# EAGLE schematic XuLA-6SLX (EAGLE 5.11)
AUTHOR: Dave Vandenbout / XESS Corp.; DIGIKEY#: 445-3447-1-ND; MANF: Xicon; MANF#: 301-5.1K-RC; MOUSER#: 301-5.1K-RC; VERSION#: 2.A

## Sheet 1 of 3
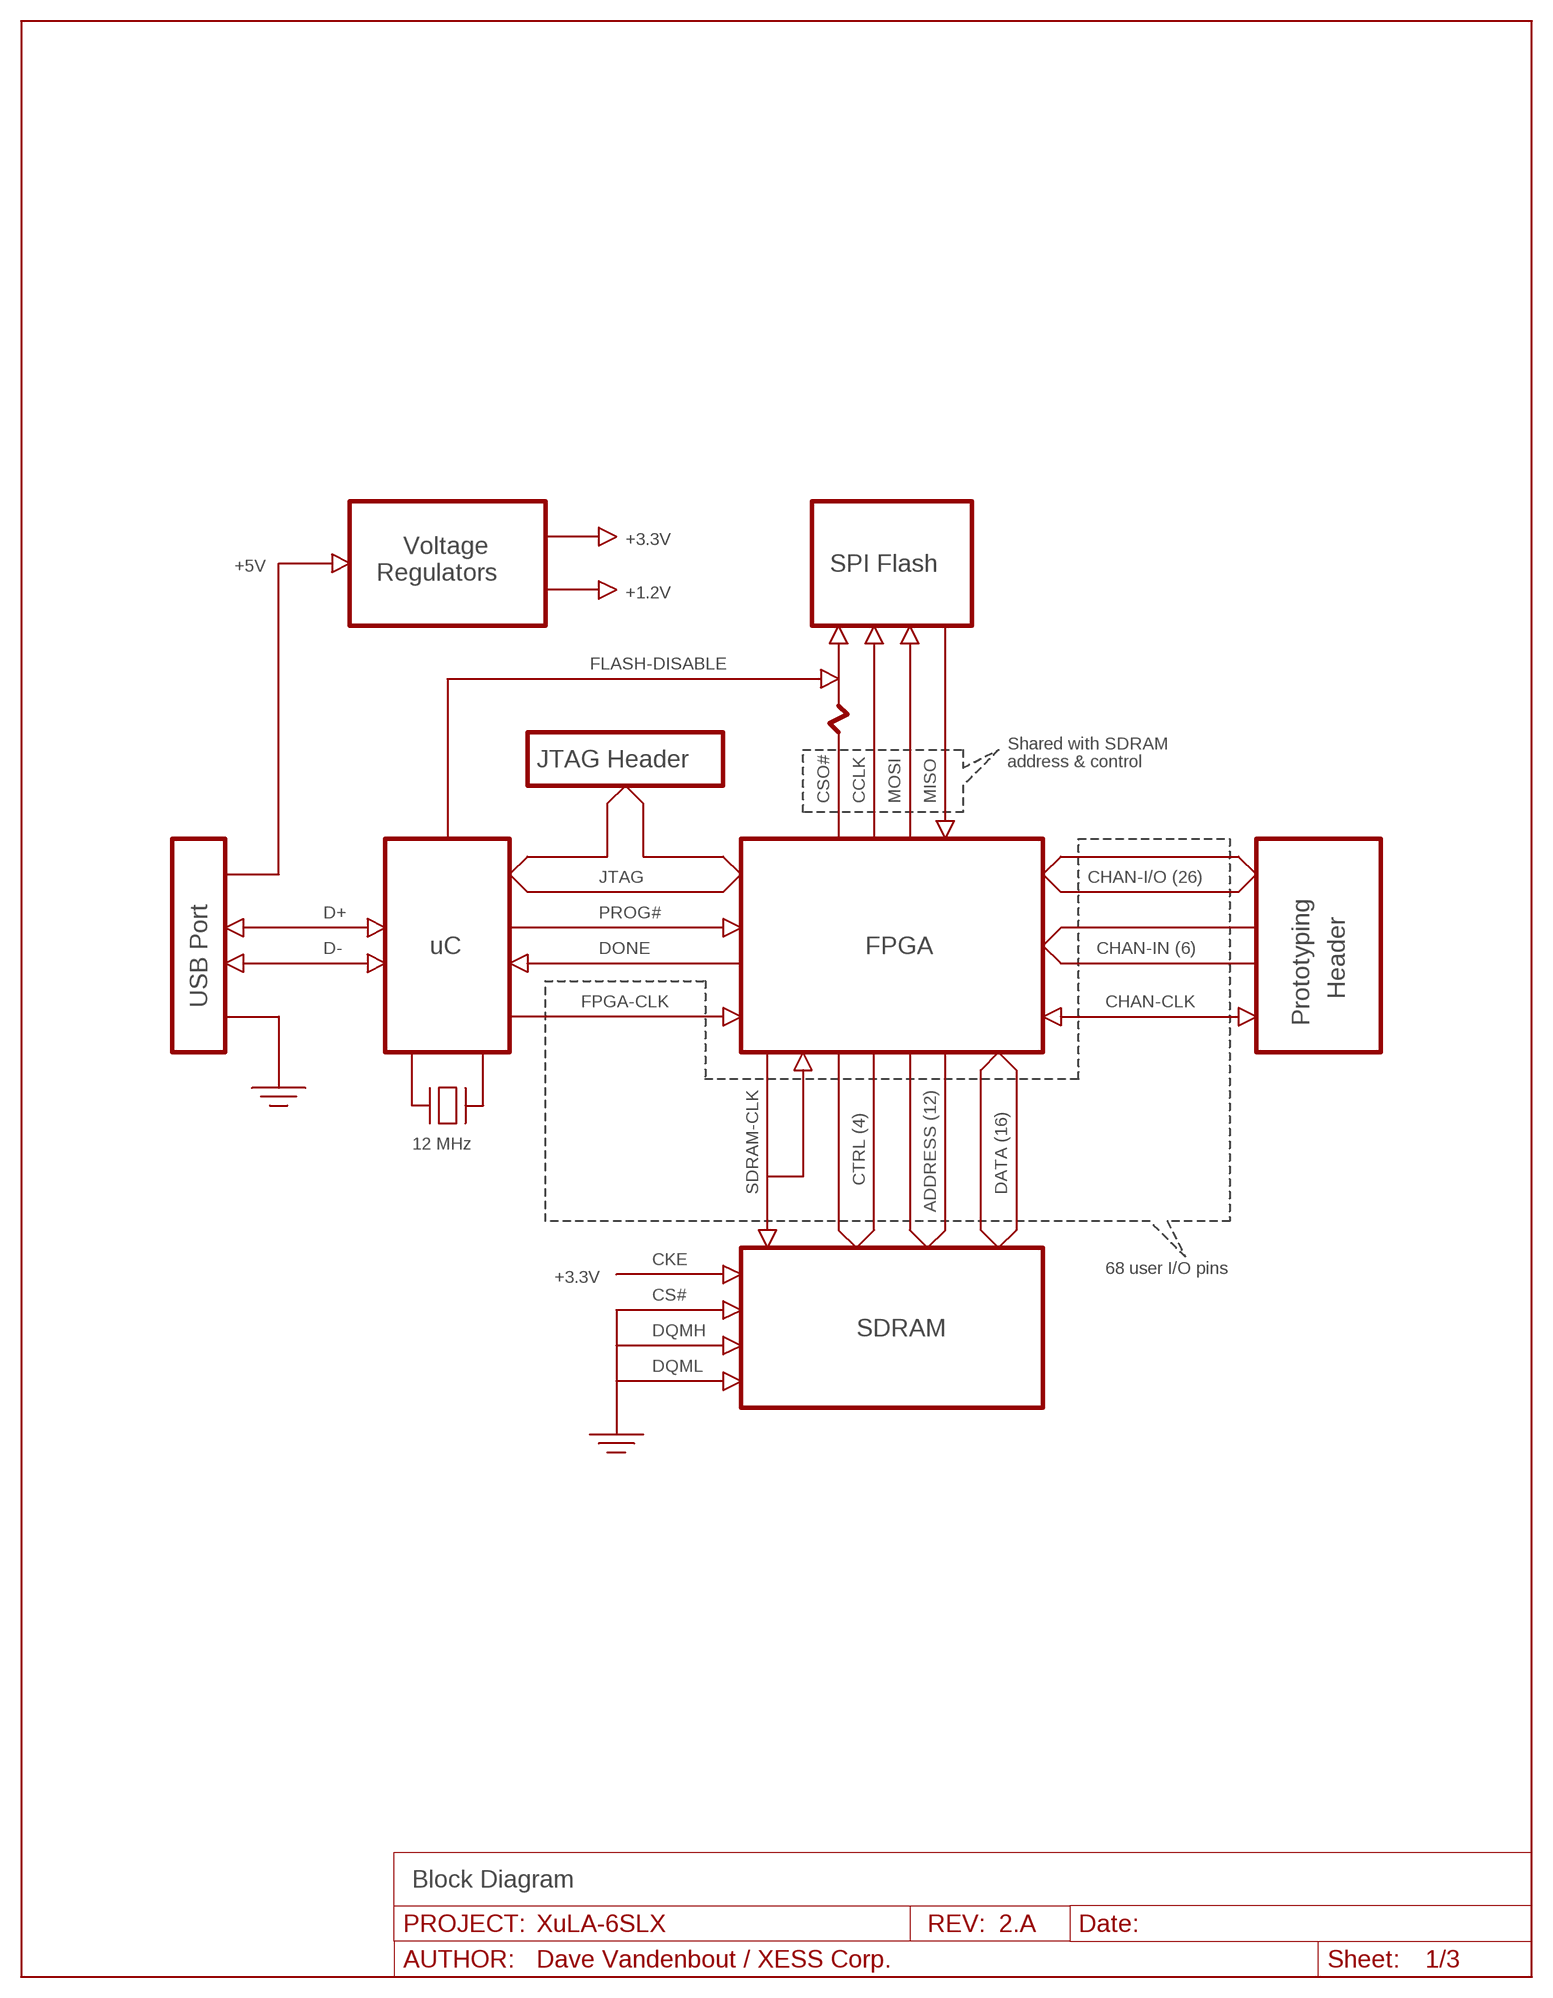
[diagram p0: schematic, sheet 1]

### Notes on the sheet
- +3.3V
- Voltage
- +5V | SPI Flash
- Regulators
- +1.2V
- FLASH-DISABLE
- Shared with SDRAM
- JTAG Header | address & control
- CSO# | CCLK | MOSI | MISO
- JTAG | CHAN-I/O (26)
- D+ | PROG#
- D- | uC | DONE | FPGA | CHAN-IN (6)
- Header
- USB Port | FPGA-CLK | CHAN-CLK
- Prototyping
- 12 MHz
- CTRL (4)
- SDRAM-CLK | DATA (16)
- ADDRESS (12)
- CKE
- 68 user I/O pins
- +3.3V
- CS#
- DQMH | SDRAM
- DQML
- Block Diagram

## Sheet 2 of 3
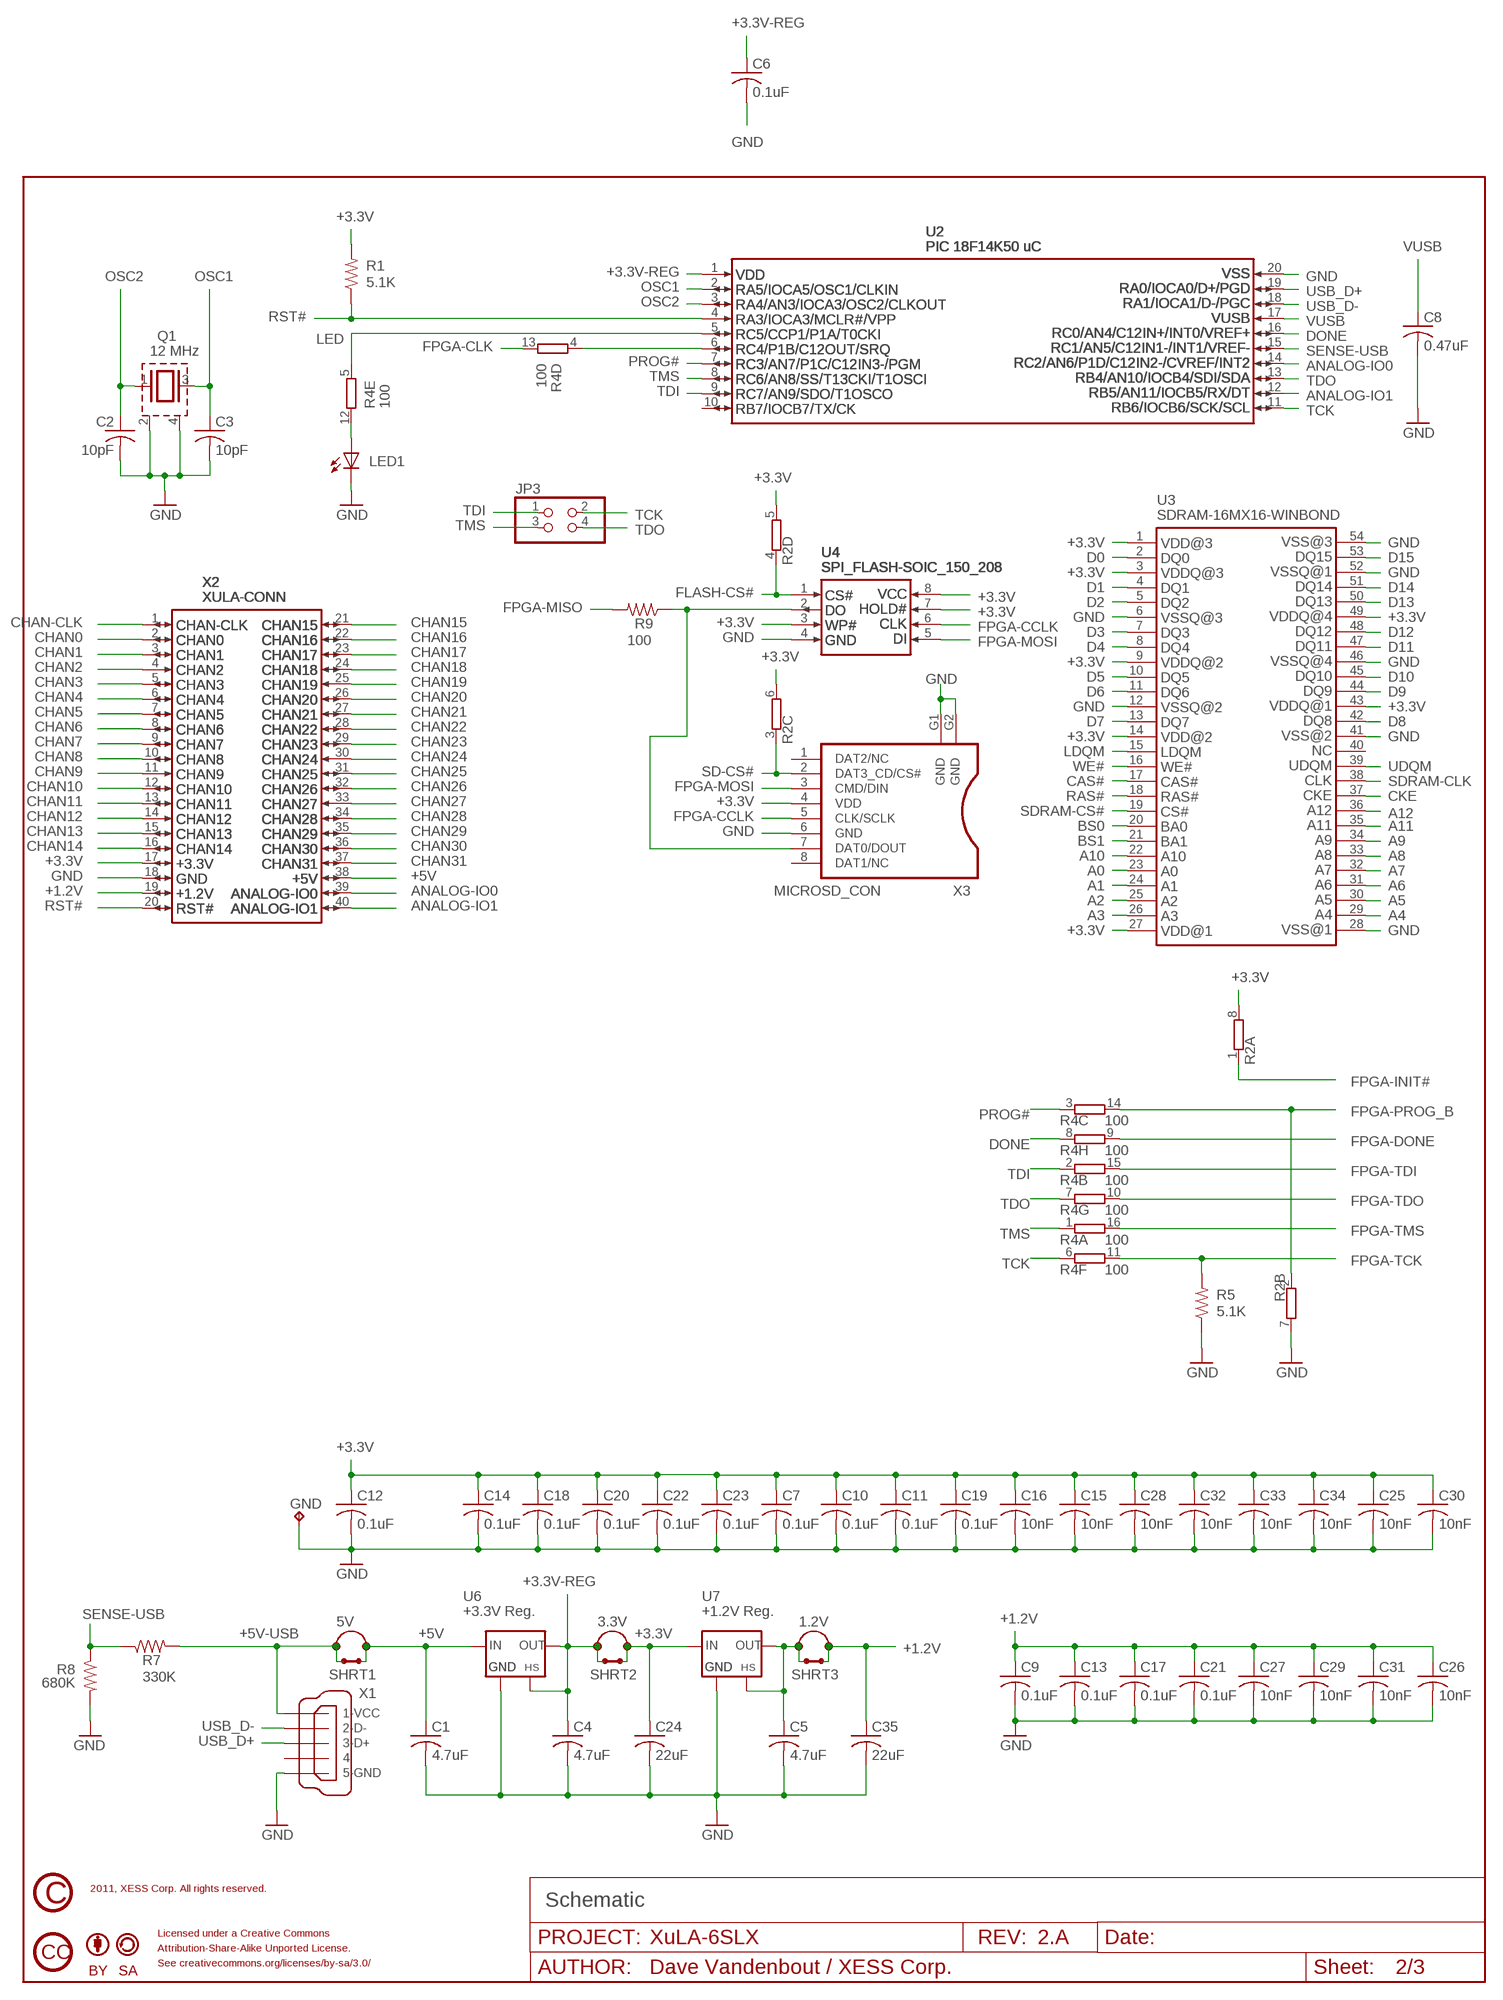
[diagram p1: schematic, sheet 2]

### Parts
1.2V  JP1QNOSILK  [JP1-NOSILK]
3.3V  JP1QNOSILK  [JP1-NOSILK]
5V  JP1QNOSILK  [JP1-NOSILK]
C1  4.7uF  C-USC0603  [C0603]
C2  10pF  C-USC0603  [C0603]
C3  10pF  C-USC0603  [C0603]
C4  4.7uF  C-USC0603  [C0603]
C5  4.7uF  C-USC0603  [C0603]
C6  0.1uF  C-USC0603  [C0603]
C7  0.1uF  C-USC0603  [C0603]
C8  0.47uF  C-USC0603  [C0603]
C9  0.1uF  C-USC0603  [C0603]
C10  0.1uF  C-USC0603  [C0603]
C11  0.1uF  C-USC0603  [C0603]
C12  0.1uF  C-USC0603  [C0603]
C13  0.1uF  C-USC0603  [C0603]
C14  0.1uF  C-USC0603  [C0603]
C15  10nF  C-USC0402  [C0402]
C16  10nF  C-USC0402  [C0402]
C17  0.1uF  C-USC0603  [C0603]
C18  0.1uF  C-USC0603  [C0603]
C19  0.1uF  C-USC0603  [C0603]
C20  0.1uF  C-USC0603  [C0603]
C21  0.1uF  C-USC0603  [C0603]
C22  0.1uF  C-USC0603  [C0603]
C23  0.1uF  C-USC0603  [C0603]
C24  22uF  C-USC1210  [C1210]
C25  10nF  C-USC0402  [C0402]
C26  10nF  C-USC0402  [C0402]
C27  10nF  C-USC0402  [C0402]
C28  10nF  C-USC0402  [C0402]
C29  10nF  C-USC0402  [C0402]
C30  10nF  C-USC0402  [C0402]
C31  10nF  C-USC0402  [C0402]
C32  10nF  C-USC0402  [C0402]
C33  10nF  C-USC0402  [C0402]
C34  10nF  C-USC0402  [C0402]
C35  22uF  C-USC1210  [C1210]
GND  TPTP-MINI  [TP-MINI]
JP3  PINHD-2X2NOSILK  [2X02-NOSILK]
LED1  LED0603  [CHIPLED-0603-TTW]
Q1  12 MHz  XTAL_CHIP32X25  [32X25]
R1  5.1K  R-US_R0603  [R0603]
R2  RES4742  [742C083]
R4  100  RES8741X  [741X163]
R5  5.1K  R-US_R0603  [R0603]
R7  330K  R-US_R0603  [R0603]
R8  680K  R-US_R0603  [R0603]
R9  100  R-US_R0603  [R0603]
SHRT1  JSHORTWIDE  [JPSHORTW]
SHRT2  JSHORTWIDE  [JPSHORTW]
SHRT3  JSHORTWIDE  [JPSHORTW]
U2  PIC 18F14K50 uC  PIC18F14K50-I/SS  [MICROCHIP-20_SSOP]
U3  SDRAM-16MX16-WINBOND  [TSOPII-54]
U4  SPI_FLASH-SOIC_150_208  [SPI-8_SOIC_150_208]
U6  +3.3V Reg.  FAN1117  [SOT223]
U7  +1.2V Reg.  FAN1112  [SOT223]
U$2  CC_CC  [CC_CC]
U$3  CC_BY  [CC_BY]
U$4  CC_SA  [CC_SA]
U$5  CC_COPYRIGHT  [CC_COPYRIGHT]
X1  MINI-USB-UX60SC-MB-5STUX60SC-MB-5ST  MINI-USB-UX60SC-MB-5ST  [UX60SC-MB-5ST]
X2  XULA-CONN  [XULA-DIP40]
X3  MICROSD_CON  [SCHD3A0100]

### Nets
+1.2V: 1.2V.2 C9.1 C13.1 C17.1 C21.1 C26.1 C27.1 C29.1 C31.1 C35.1 SHRT3.2 X2.19 ; also sheet 3
+3.3V: 3.3V.2 C7.1 C10.1 C11.1 C12.1 C14.1 C15.1 C16.1 C18.1 C19.1 C20.1 C22.1 C23.1 C24.1 C25.1 C28.1 C30.1 C32.1 C33.1 C34.1 R1.2 R2.5 R2.6 R2.8 SHRT2.2 U3.1 U3.3 U3.9 U3.14 U3.27 U3.43 U3.49 U4.3 U4.7 U4.8 U7.3(IN) X2.17 X3.4(VDD) ; also sheet 3
+3.3V-REG: 3.3V.1 C4.1 C6.1 SHRT2.1 U2.1 U6.2(OUT) U6.4(HS)
+5V: 5V.2 C1.1 SHRT1.2 U6.3(IN) X2.38
+5V-USB: 5V.1 R7.2 SHRT1.1 X1.1(1-VCC)
A0: U3.23 ; also sheet 3
A1: U3.24 ; also sheet 3
A2: U3.25 ; also sheet 3
A3: U3.26 ; also sheet 3
A4: U3.29 ; also sheet 3
A5: U3.30 ; also sheet 3
A6: U3.31 ; also sheet 3
A7: U3.32 ; also sheet 3
A8: U3.33 ; also sheet 3
A9: U3.34 ; also sheet 3
A10: U3.22 ; also sheet 3
A11: U3.35 ; also sheet 3
A12: U3.36 ; also sheet 3
ANALOG-IO0: U2.14 X2.39
ANALOG-IO1: U2.12 X2.40
BS0: U3.20 ; also sheet 3
BS1: U3.21 ; also sheet 3
CAS#: U3.17 ; also sheet 3
CHAN0: X2.2 ; also sheet 3
CHAN1: X2.3 ; also sheet 3
CHAN2: X2.4 ; also sheet 3
CHAN3: X2.5 ; also sheet 3
CHAN4: X2.6 ; also sheet 3
CHAN5: X2.7 ; also sheet 3
CHAN6: X2.8 ; also sheet 3
CHAN7: X2.9 ; also sheet 3
CHAN8: X2.10 ; also sheet 3
CHAN9: X2.11 ; also sheet 3
CHAN10: X2.12 ; also sheet 3
CHAN11: X2.13 ; also sheet 3
CHAN12: X2.14 ; also sheet 3
CHAN13: X2.15 ; also sheet 3
CHAN14: X2.16 ; also sheet 3
CHAN15: X2.21 ; also sheet 3
CHAN16: X2.22 ; also sheet 3
CHAN17: X2.23 ; also sheet 3
CHAN18: X2.24 ; also sheet 3
CHAN19: X2.25 ; also sheet 3
CHAN20: X2.26 ; also sheet 3
CHAN21: X2.27 ; also sheet 3
CHAN22: X2.28 ; also sheet 3
CHAN23: X2.29 ; also sheet 3
CHAN24: X2.30 ; also sheet 3
CHAN25: X2.31 ; also sheet 3
CHAN26: X2.32 ; also sheet 3
CHAN27: X2.33 ; also sheet 3
CHAN28: X2.34 ; also sheet 3
CHAN29: X2.35 ; also sheet 3
CHAN30: X2.36 ; also sheet 3
CHAN31: X2.37 ; also sheet 3
CHAN-CLK: X2.1 ; also sheet 3
CKE: U3.37 ; also sheet 3
D0: U3.2 ; also sheet 3
D1: U3.4 ; also sheet 3
D2: U3.5 ; also sheet 3
D3: U3.7 ; also sheet 3
D4: U3.8 ; also sheet 3
D5: U3.10 ; also sheet 3
D6: U3.11 ; also sheet 3
D7: U3.13 ; also sheet 3
D8: U3.42 ; also sheet 3
D9: U3.44 ; also sheet 3
D10: U3.45 ; also sheet 3
D11: U3.47 ; also sheet 3
D12: U3.48 ; also sheet 3
D13: U3.50 ; also sheet 3
D14: U3.51 ; also sheet 3
D15: U3.53 ; also sheet 3
DONE: R4.8 U2.16
FLASH-CS#: R2.4 U4.1 ; also sheet 3
FPGA-CCLK: U4.6 X3.5(CLK/SCLK) ; also sheet 3
FPGA-CLK: R4.13 ; also sheet 3
FPGA-DONE: R4.9 ; also sheet 3
FPGA-INIT#: R2.1 ; also sheet 3
FPGA-MISO: R9.2 ; also sheet 3
FPGA-MOSI: U4.5 X3.3(CMD/DIN) ; also sheet 3
FPGA-PROG_B: R2.2 R4.14 ; also sheet 3
FPGA-TCK: R4.11 R5.2 ; also sheet 3
FPGA-TDI: R4.15 ; also sheet 3
FPGA-TDO: R4.10 ; also sheet 3
FPGA-TMS: R4.16 ; also sheet 3
GND: C1.2 C2.2 C3.2 C4.2 C5.2 C6.2 C7.2 C8.2 C9.2 C10.2 C11.2 C12.2 C13.2 C14.2 C15.2 C16.2 C17.2 C18.2 C19.2 C20.2 C21.2 C22.2 C23.2 C24.2 C25.2 C26.2 C27.2 C28.2 C29.2 C30.2 C31.2 C32.2 C33.2 C34.2 C35.2 GND.1(TP) LED1.C Q1.2 Q1.4 R2.7 R5.1 R8.2 U2.20 U3.6 U3.12 U3.28 U3.41 U3.46 U3.52 U3.54 U4.4 U6.1(GND) U7.1(GND) X1.5(5-GND) X2.18 X3.6(GND) X3.G1(GND) X3.G2(GND) ; also sheet 3
LDQM: U3.15 ; also sheet 3
LED: R4.5 U2.5
N$2: 1.2V.1 C5.1 SHRT3.1 U7.2(OUT) U7.4(HS)
N$7: R4.4 U2.6
N$8: R9.1 U4.2 X3.7(DAT0/DOUT)
N$11: LED1.A R4.12
OSC1: C3.1 Q1.3 U2.2
OSC2: C2.1 Q1.1 U2.3
PROG#: R4.3 U2.7
RAS#: U3.18 ; also sheet 3
RST#: R1.1 U2.4 X2.20
SD-CS#: R2.3 X3.2(DAT3_CD/CS#) ; also sheet 3
SDRAM-CLK: U3.38 ; also sheet 3
SDRAM-CS#: U3.19 ; also sheet 3
SENSE-USB: R7.1 R8.1 U2.15
TCK: JP3.2 R4.6 U2.11
TDI: JP3.1 R4.2 U2.9
TDO: JP3.4 R4.7 U2.13
TMS: JP3.3 R4.1 U2.8
UDQM: U3.39 ; also sheet 3
USB_D+: U2.19 X1.3(3-D+)
USB_D-: U2.18 X1.2(2-D-)
VUSB: C8.1 U2.17
WE#: U3.16 ; also sheet 3
Unconnected: U2.10 U3.40 X1.4 X3.1(DAT2/NC) X3.8(DAT1/NC)

### Notes on the sheet
- 2011, XESS Corp. All rights reserved.
- Schematic
- Licensed under a Creative Commons
- Attribution-Share-Alike Unported License.
- See creativecommons.org/licenses/by-sa/3.0/

## Sheet 3 of 3
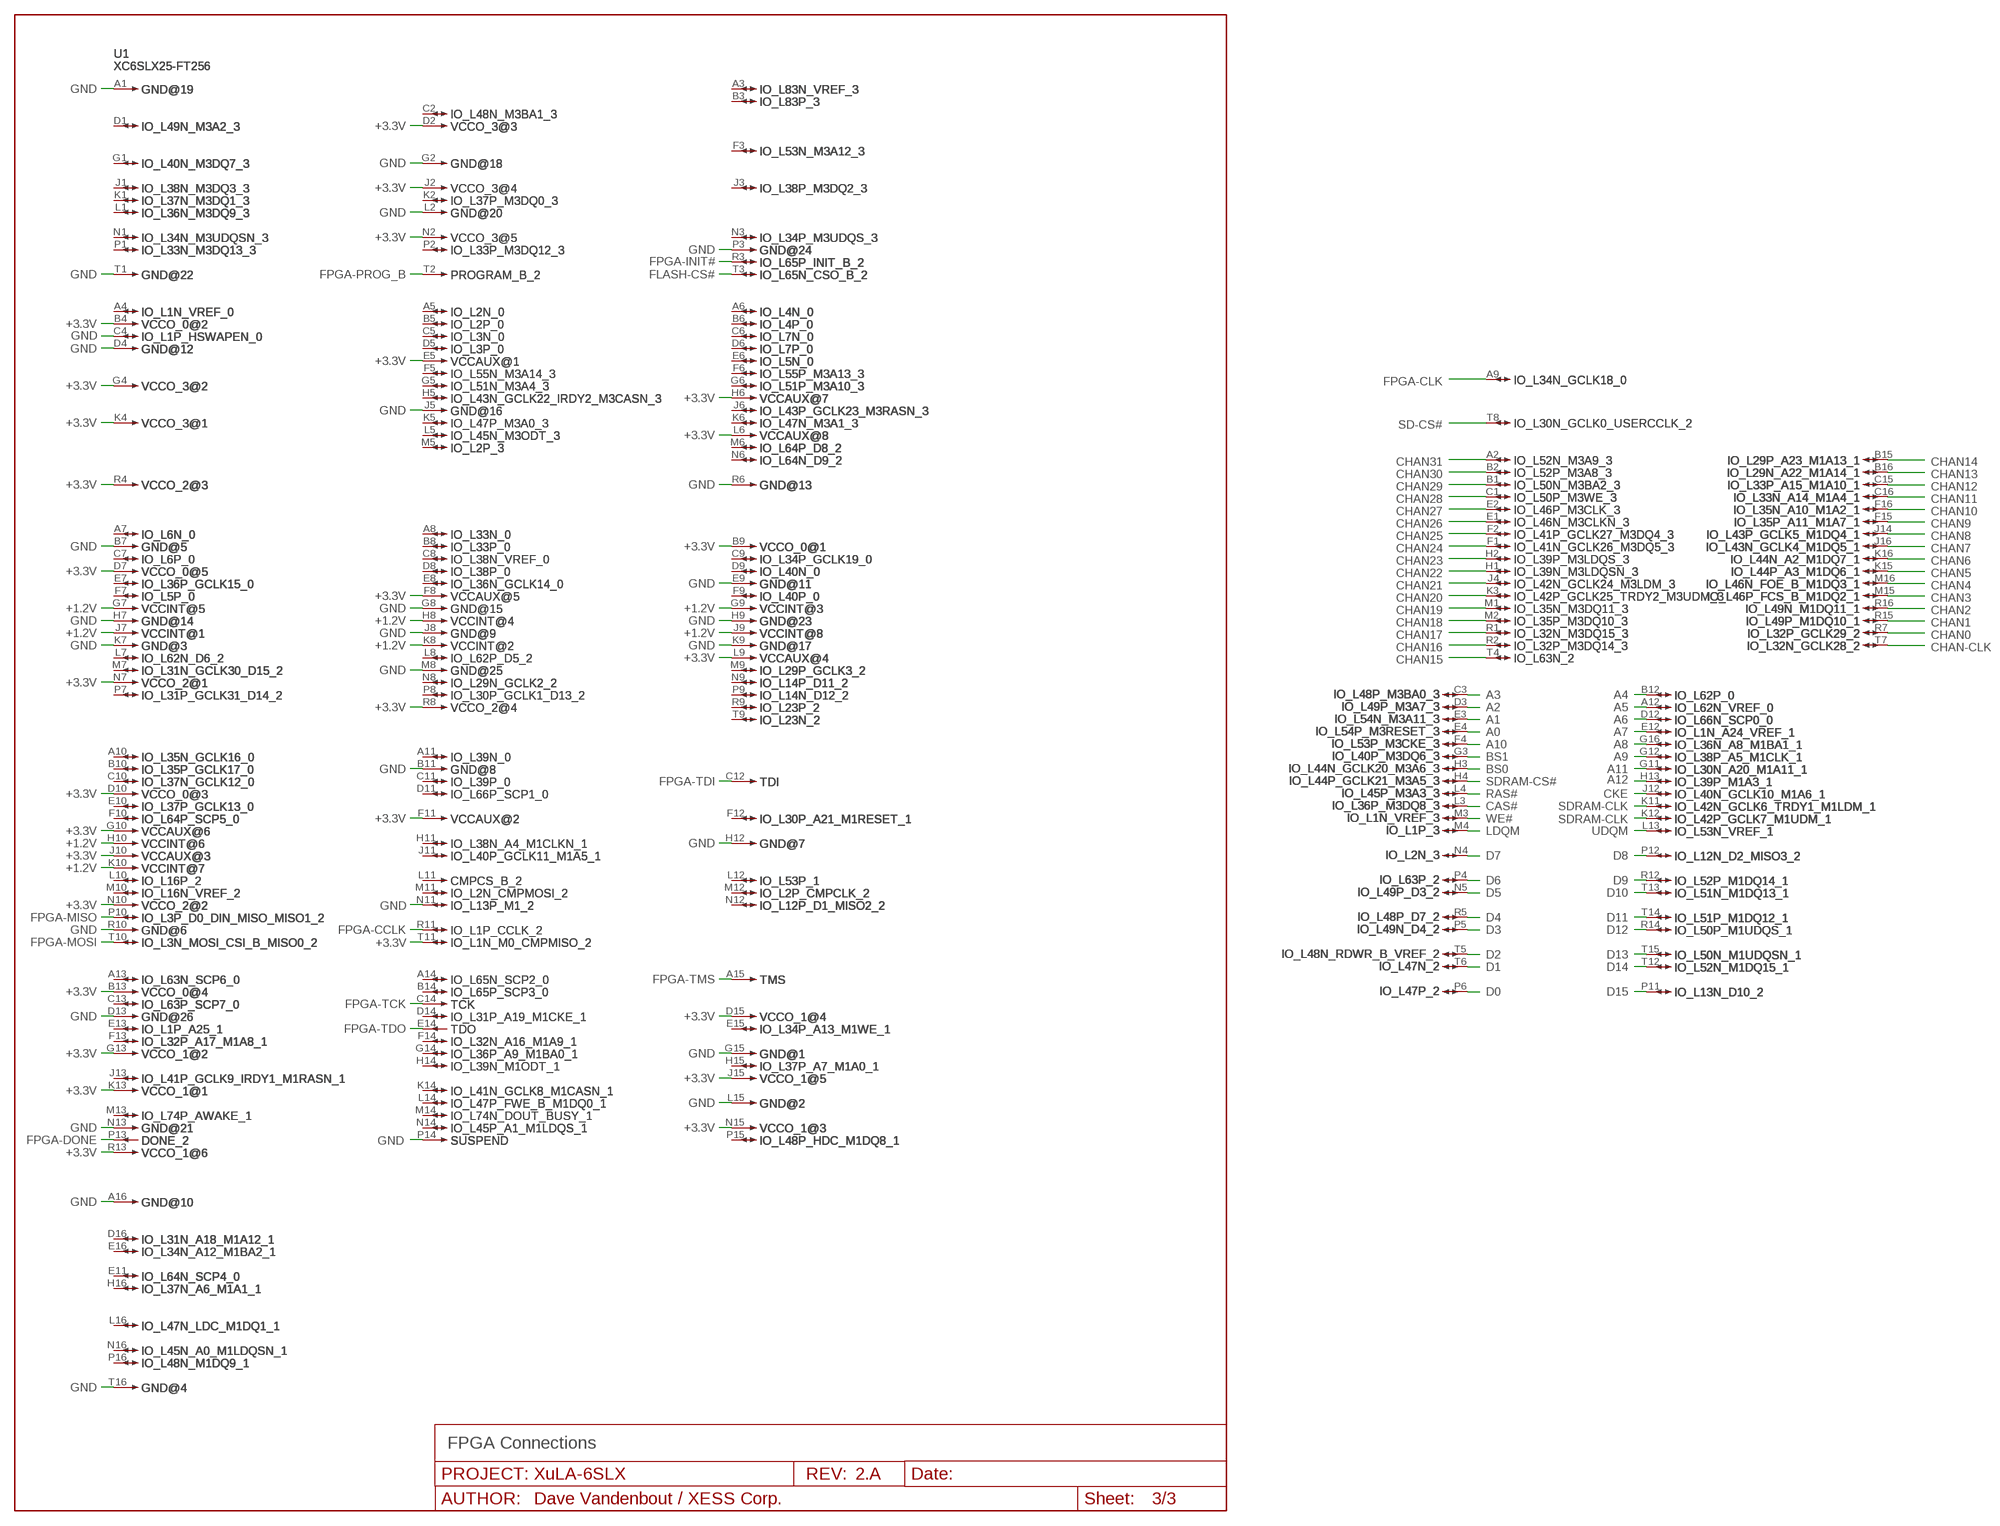
[diagram p2: schematic, sheet 3]

### Parts
U1  XC6SLX25-FT256  [XILINX-FT256]

### Nets
+1.2V: U1.G7 U1.G9 U1.H8 U1.H10 U1.J7 U1.J9 U1.K8 U1.K10 ; also sheet 2
+3.3V: U1.B4 U1.B9 U1.B13 U1.D2 U1.D7 U1.D10 U1.D15 U1.E5 U1.F8 U1.F11 U1.G4 U1.G10 U1.G13 U1.H6 U1.J2 U1.J10 U1.J15 U1.K4 U1.K13 U1.L6 U1.L9 U1.N2 U1.N7 U1.N10 U1.N15 U1.R4 U1.R8 U1.R13 U1.T11 ; also sheet 2
A0: U1.E4 ; also sheet 2
A1: U1.E3 ; also sheet 2
A2: U1.D3 ; also sheet 2
A3: U1.C3 ; also sheet 2
A4: U1.B12 ; also sheet 2
A5: U1.A12 ; also sheet 2
A6: U1.D12 ; also sheet 2
A7: U1.E12 ; also sheet 2
A8: U1.G16 ; also sheet 2
A9: U1.G12 ; also sheet 2
A10: U1.F4 ; also sheet 2
A11: U1.G11 ; also sheet 2
A12: U1.H13 ; also sheet 2
BS0: U1.H3 ; also sheet 2
BS1: U1.G3 ; also sheet 2
CAS#: U1.L3 ; also sheet 2
CHAN0: U1.R7 ; also sheet 2
CHAN1: U1.R15 ; also sheet 2
CHAN2: U1.R16 ; also sheet 2
CHAN3: U1.M15 ; also sheet 2
CHAN4: U1.M16 ; also sheet 2
CHAN5: U1.K15 ; also sheet 2
CHAN6: U1.K16 ; also sheet 2
CHAN7: U1.J16 ; also sheet 2
CHAN8: U1.J14 ; also sheet 2
CHAN9: U1.F15 ; also sheet 2
CHAN10: U1.F16 ; also sheet 2
CHAN11: U1.C16 ; also sheet 2
CHAN12: U1.C15 ; also sheet 2
CHAN13: U1.B16 ; also sheet 2
CHAN14: U1.B15 ; also sheet 2
CHAN15: U1.T4 ; also sheet 2
CHAN16: U1.R2 ; also sheet 2
CHAN17: U1.R1 ; also sheet 2
CHAN18: U1.M2 ; also sheet 2
CHAN19: U1.M1 ; also sheet 2
CHAN20: U1.K3 ; also sheet 2
CHAN21: U1.J4 ; also sheet 2
CHAN22: U1.H1 ; also sheet 2
CHAN23: U1.H2 ; also sheet 2
CHAN24: U1.F1 ; also sheet 2
CHAN25: U1.F2 ; also sheet 2
CHAN26: U1.E1 ; also sheet 2
CHAN27: U1.E2 ; also sheet 2
CHAN28: U1.C1 ; also sheet 2
CHAN29: U1.B1 ; also sheet 2
CHAN30: U1.B2 ; also sheet 2
CHAN31: U1.A2 ; also sheet 2
CHAN-CLK: U1.T7 ; also sheet 2
CKE: U1.J12 ; also sheet 2
D0: U1.P6 ; also sheet 2
D1: U1.T6 ; also sheet 2
D2: U1.T5 ; also sheet 2
D3: U1.P5 ; also sheet 2
D4: U1.R5 ; also sheet 2
D5: U1.N5 ; also sheet 2
D6: U1.P4 ; also sheet 2
D7: U1.N4 ; also sheet 2
D8: U1.P12 ; also sheet 2
D9: U1.R12 ; also sheet 2
D10: U1.T13 ; also sheet 2
D11: U1.T14 ; also sheet 2
D12: U1.R14 ; also sheet 2
D13: U1.T15 ; also sheet 2
D14: U1.T12 ; also sheet 2
D15: U1.P11 ; also sheet 2
FLASH-CS#: U1.T3 ; also sheet 2
FPGA-CCLK: U1.R11 ; also sheet 2
FPGA-CLK: U1.A9 ; also sheet 2
FPGA-DONE: U1.P13 ; also sheet 2
FPGA-INIT#: U1.R3 ; also sheet 2
FPGA-MISO: U1.P10 ; also sheet 2
FPGA-MOSI: U1.T10 ; also sheet 2
FPGA-PROG_B: U1.T2 ; also sheet 2
FPGA-TCK: U1.C14 ; also sheet 2
FPGA-TDI: U1.C12 ; also sheet 2
FPGA-TDO: U1.E14 ; also sheet 2
FPGA-TMS: U1.A15 ; also sheet 2
GND: U1.A1 U1.A16 U1.B7 U1.B11 U1.C4 U1.D4 U1.D13 U1.E9 U1.G2 U1.G8 U1.G15 U1.H7 U1.H9 U1.H12 U1.J5 U1.J8 U1.K7 U1.K9 U1.L2 U1.L15 U1.M8 U1.N11 U1.N13 U1.P3 U1.P14 U1.R6 U1.R10 U1.T1 U1.T16 ; also sheet 2
LDQM: U1.M4 ; also sheet 2
RAS#: U1.L4 ; also sheet 2
SD-CS#: U1.T8 ; also sheet 2
SDRAM-CLK: U1.K11 U1.K12 ; also sheet 2
SDRAM-CS#: U1.H4 ; also sheet 2
UDQM: U1.L13 ; also sheet 2
WE#: U1.M3 ; also sheet 2
Unconnected: U1.A3 U1.A4 U1.A5 U1.A6 U1.A7 U1.A8 U1.A10 U1.A11 U1.A13 U1.A14 U1.B3 U1.B5 U1.B6 U1.B8 U1.B10 U1.B14 U1.C2 U1.C5 U1.C6 U1.C7 U1.C8 U1.C9 U1.C10 U1.C11 U1.C13 U1.D1 U1.D5 U1.D6 U1.D8 U1.D9 U1.D11 U1.D14 U1.D16 U1.E6 U1.E7 U1.E8 U1.E10 U1.E11 U1.E13 U1.E15 U1.E16 U1.F3 U1.F5 U1.F6 U1.F7 U1.F9 U1.F10 U1.F12 U1.F13 U1.F14 U1.G1 U1.G5 U1.G6 U1.G14 U1.H5 U1.H11 U1.H14 U1.H15 U1.H16 U1.J1 U1.J3 U1.J6 U1.J11 U1.J13 U1.K1 U1.K2 U1.K5 U1.K6 U1.K14 U1.L1 U1.L5 U1.L7 U1.L8 U1.L10 U1.L11 U1.L12 U1.L14 U1.L16 U1.M5 U1.M6 U1.M7 U1.M9 U1.M10 U1.M11 U1.M12 U1.M13 U1.M14 U1.N1 U1.N3 U1.N6 U1.N8 U1.N9 U1.N12 U1.N14 U1.N16 U1.P1 U1.P2 U1.P7 U1.P8 U1.P9 U1.P15 U1.P16 U1.R9 U1.T9

### Notes on the sheet
- FPGA Connections

## Library data of the parts
1.2V 3.3V 5V = xess:JP1Q: JUMPER
C1-C35 = rcl:C-US: CAPACITOR, American symbol
GND = xess:TP: Test Point
JP3 = pinhead:PINHD-2X2: PIN HEADER
LED1 = xess:LED: LED
Q1 = xess:XTAL_CHIP: Crystal Chip; DIGIKEY#: 535-10901-1-ND; MANF: Abracon; MANF#: ABM8G-12.000MHZ-4Y-T3; MOUSER#: 815-ABM8G-12-B4Y-T
R1 R5 R7-R9 = rcl:R-US_: RESISTOR, American symbol
R2 = xess:RES4: Resistor 4-pack Package of four resistors.; DIGIKEY#: 742C083???JPCT-ND; MANF: CTS Resistor Products; MANF#: 742C083???JPTR; MOUSER#: 774-742C083???JP
R4 = xess:RES8: Resistor 8-pack Package of eight resistors.
SHRT1-SHRT3 = xess:JSHORT: Bridge
U1 = xess:XC6SLX25-FT256: Xilinx Spartan 6 25-KLUT FPGA in FT256 package
U2 = xess:PIC18F14K50: Microchip PIC 18F14K50 Microcontroller; DIGIKEY#: PIC18F14K50-I/SS-ND; MANF: Microchip; MANF#: PIC18F14K50-I/SS; MOUSER#: 579-PIC18F14K50-I/SS
U3 = xess:SDRAM-16MX16; MANF: Winbond; MANF#: W9825G6JH-5
U4 = xess:SPI_FLASH: SPI Flash; MANF: Winbond
U6 = xess:FAN1117: +3.3V Linear Regulator
U7 = xess:FAN1112: +1.2V Linear Regulator
U$2 = xess:CC_CC
U$3 = xess:CC_BY
U$4 = xess:CC_SA
U$5 = xess:CC_COPYRIGHT
X1 = xess:MINI-USB-: MINI USB Connector Source: http://www.hirose.co.jp/cataloge_hp/e24000019.pdf; DIGIKEY#: H11589CT-ND; MANF: Hirose; MANF#: UX60SC-MB-5ST; MOUSER#: 798-UX60SC-MB-5ST
X2 = xess:XULA-CONN: XuLA Board Connector
X3 = xess:MICROSD_CON: MicroSD Card Connector

## Net classes
1 power: clearance 0.254 mm